# Altium schematic sheet WiFI_ESP.SchDoc
size A4; SheetNumber: 11; SheetTotal: 15
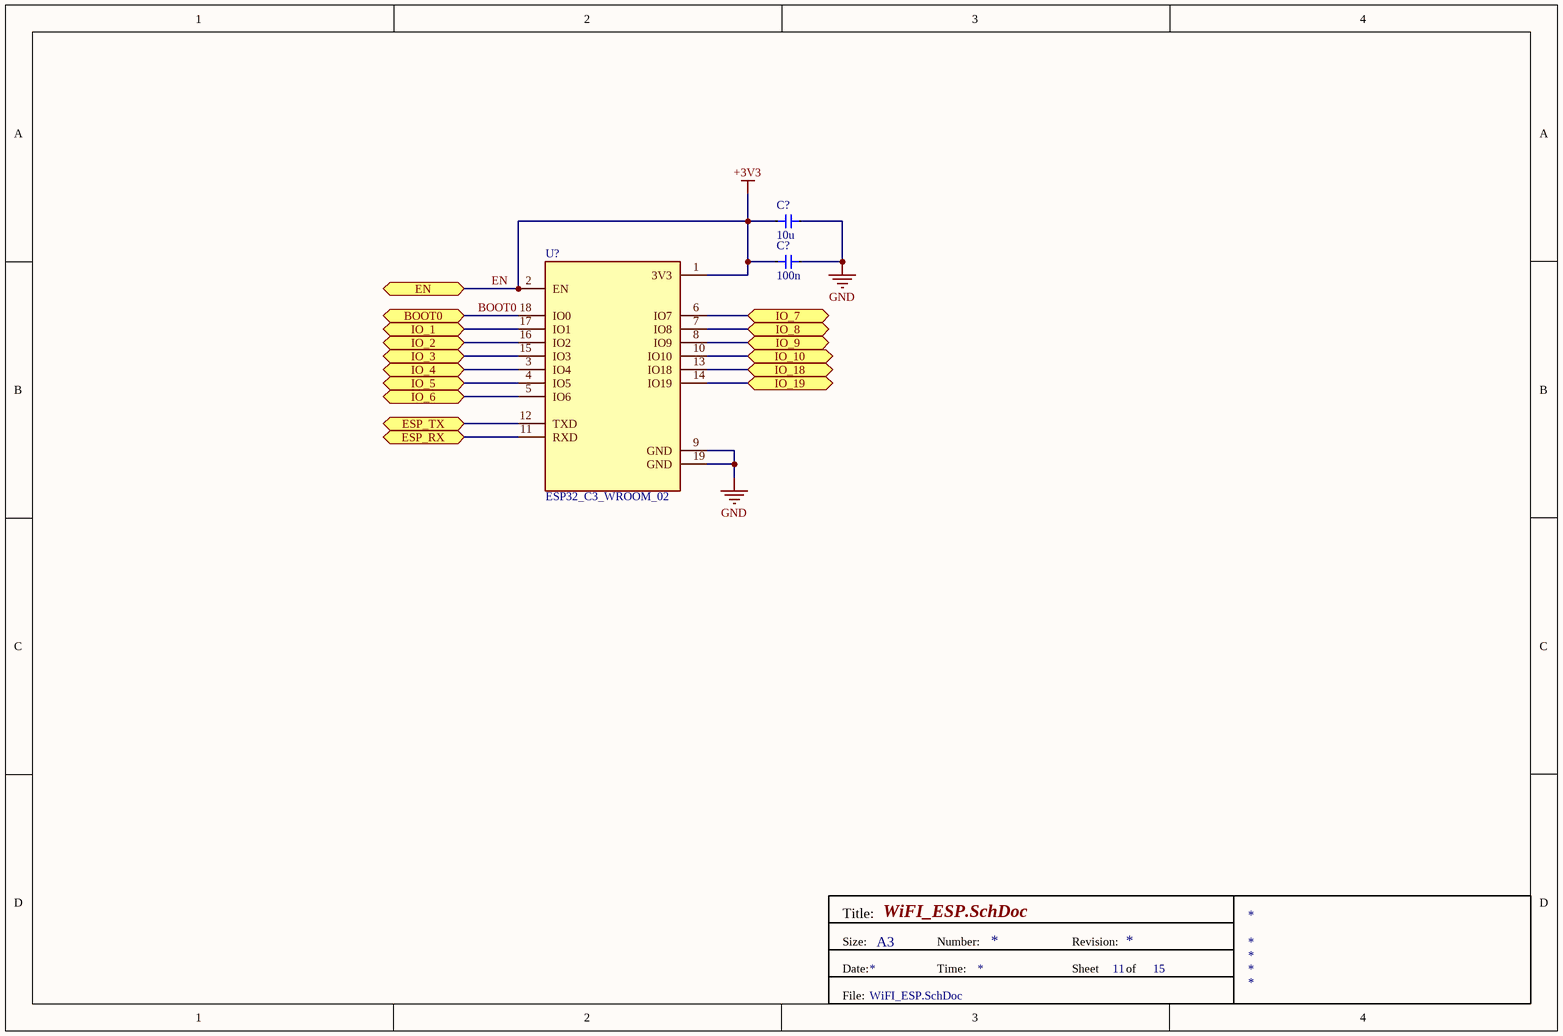
[diagram p0: WiFI_ESP.SchDoc]

## Parts
(Parts that share a designator on the sheet are numbered #1, #2 ... from top to bottom, then left to right.)
C?#1  10u  [Cap 0603]
C?#2  100n  [Cap 0603]
U?  ESP32_C3_WROOM_02  [ESP32_C3]

## Ports
BOOT0 (bidir), EN (bidir), ESP_RX (bidir), ESP_TX (bidir), IO_1 (bidir), IO_2 (bidir), IO_3 (bidir), IO_4 (bidir), IO_5 (bidir), IO_6 (bidir), IO_7 (bidir), IO_8 (bidir), IO_9 (bidir), IO_10 (bidir), IO_18 (bidir), IO_19 (bidir)

## Nets
EN: C?#1.2 C?#2.2 U?.1(3V3) U?.2(EN) ; port EN  [also labelled +3V3]
GND: C?#1.1 C?#2.1 U?.9(GND) U?.19(GND)
BOOT0: U?.18(IO0) ; port BOOT0
ESP_RX: U?.11(RXD) ; port ESP_RX
ESP_TX: U?.12(TXD) ; port ESP_TX
IO_1: U?.17(IO1) ; port IO_1
IO_2: U?.16(IO2) ; port IO_2
IO_3: U?.15(IO3) ; port IO_3
IO_4: U?.3(IO4) ; port IO_4
IO_5: U?.4(IO5) ; port IO_5
IO_6: U?.5(IO6) ; port IO_6
IO_7: U?.6(IO7) ; port IO_7
IO_8: U?.7(IO8) ; port IO_8
IO_9: U?.8(IO9) ; port IO_9
IO_10: U?.10(IO10) ; port IO_10
IO_18: U?.13(IO18) ; port IO_18
IO_19: U?.14(IO19) ; port IO_19

## Notes on the sheet
- Title:
- Size:
- Date:
- A3
- Number:
- Time:
- Revision:
- Sheet
- of
- File:

## Library data of the parts
C?#1 C?#2 = Cap 0603: Capacitor SMD 0603
U? = ESP32_C3_WROOM_02: Ultra-Low-Power SoC with RISC-V Single-Core CPU / 2.4 GHz Wi-Fi (802.11b/g/n) and Bluetooth® 5 (LE) / Optional 4 MB flash in the chip’s package / QFN32 (5×5 mm) package